# Altium schematic sheet SCH_CPU.SchDoc
size A4
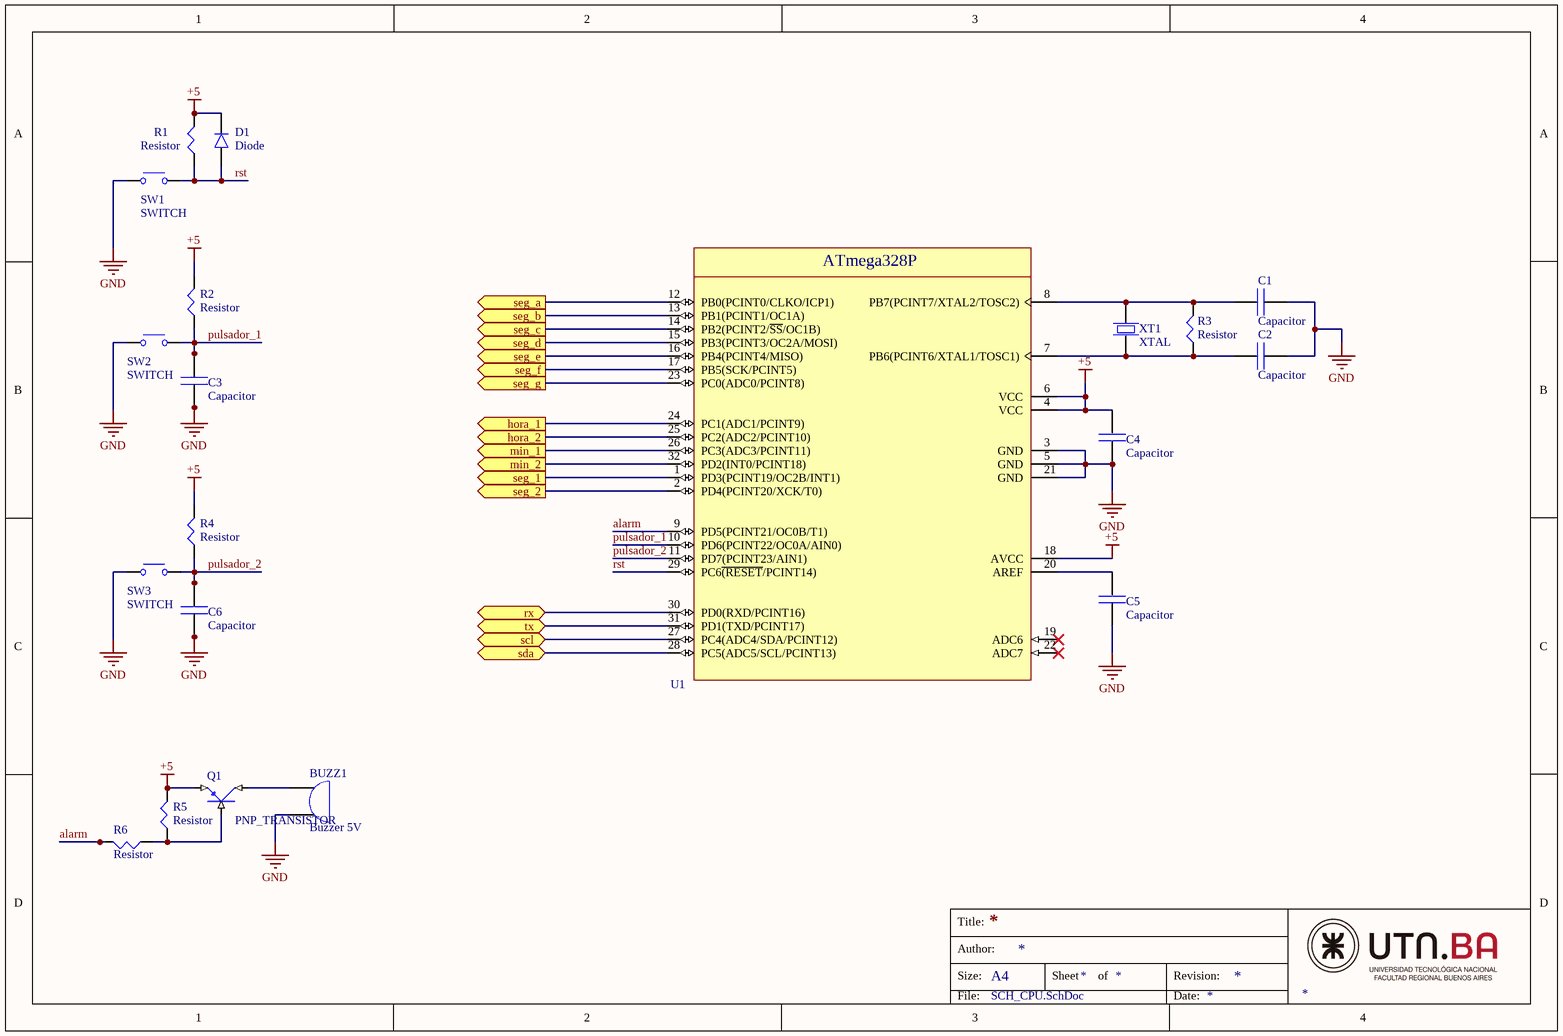
[diagram p0: SCH_CPU.SchDoc]

## Parts
BUZZ1  Buzzer 5V
C1  Capacitor
C2  Capacitor
C3  Capacitor
C4  Capacitor
C5  Capacitor
C6  Capacitor
D1  Diode
Q1  PNP_TRANSISTOR
R1  Resistor
R2  Resistor
R3  Resistor
R4  Resistor
R5  Resistor
R6  Resistor
SW1  SWITCH
SW2  SWITCH
SW3  SWITCH
U1  ATmega328P  (value not drawn)
XT1  XTAL

## Ports
hora_1 (out), hora_2 (out), min_1 (out), min_2 (out), rx (bidir), scl (bidir), sda (bidir), seg_1 (out), seg_2 (out), seg_a (out), seg_b (out), seg_c (out), seg_d (out), seg_e (out), seg_f (out), seg_g (out), tx (bidir)

## Nets
+5: C4.39 D1.35 Q1.3(E) R1.48 R2.48 R4.48 R5.48 U1.4(VCC) U1.6(VCC) U1.18(AVCC)
GND: BUZZ1.27 C1.38 C2.38 C3.38 C4.38 C5.38 C6.38 SW1.7 SW2.7 SW3.7 U1.3(GND) U1.5(GND) U1.21(GND)
alarm: R6.48 U1.9(PD5(PCINT21/OC0B/T1))
hora_1: U1.24(PC1(ADC1/PCINT9)) ; port hora_1
hora_2: U1.25(PC2(ADC2/PCINT10)) ; port hora_2
min_1: U1.26(PC3(ADC3/PCINT11)) ; port min_1
min_2: U1.32(PD2(INT0/PCINT18)) ; port min_2
pulsador_1: C3.39 R2.47 SW2.6 U1.10(PD6(PCINT22/OC0A/AIN0))
pulsador_2: C6.39 R4.47 SW3.6 U1.11(PD7(PCINT23/AIN1))
rst: D1.34 R1.47 SW1.6 U1.29(PC6~{(RESET}/PCINT14))
rx: U1.30(PD0(RXD/PCINT16)) ; port rx
scl: U1.27(PC4(ADC4/SDA/PCINT12)) ; port scl
sda: U1.28(PC5(ADC5/SCL/PCINT13)) ; port sda
seg_1: U1.1(PD3(PCINT19/OC2B/INT1)) ; port seg_1
seg_2: U1.2(PD4(PCINT20/XCK/T0)) ; port seg_2
seg_a: U1.12(PB0(PCINT0/CLKO/ICP1)) ; port seg_a
seg_b: U1.13(PB1(PCINT1/OC1A)) ; port seg_b
seg_c: U1.14(PB2(PCINT2/~{SS}/OC1B)) ; port seg_c
seg_d: U1.15(PB3(PCINT3/OC2A/MOSI)) ; port seg_d
seg_e: U1.16(PB4(PCINT4/MISO)) ; port seg_e
seg_f: U1.17(PB5(SCK/PCINT5)) ; port seg_f
seg_g: U1.23(PC0(ADC0/PCINT8)) ; port seg_g
tx: U1.31(PD1(TXD/PCINT17)) ; port tx
NetBUZZ1_26: BUZZ1.26 Q1.2(C)
NetC1_39: C1.39 R3.48 U1.8(PB7(PCINT7/XTAL2/TOSC2)) XT1.4
NetC2_39: C2.39 R3.47 U1.7(PB6(PCINT6/XTAL1/TOSC1)) XT1.5
NetC5_39: C5.39 U1.20(AREF)
NetQ1_1: Q1.1(B) R5.47 R6.47

Not connected (* = marked no-connect by the designer): U1 19(ADC6)* 22(ADC7)*

## Notes on the sheet
- Title:
- Size:
- Author:
- A4
- Sheet
- of
- Revision:
- File:
- Date:

## Library data of the parts
BUZZ1 = Buzzer
C1-C6 = Capacitor: 100nF x 50v
D1 = Diode: Signal Diode
SW1-SW3 = SWITCH: NO Switch
U1 = ATmega328P: Microcontroller
XT1 = XTAL: crystal piezoelectric